# EAGLE design demo_46k22 (EAGLE 9.6.2)
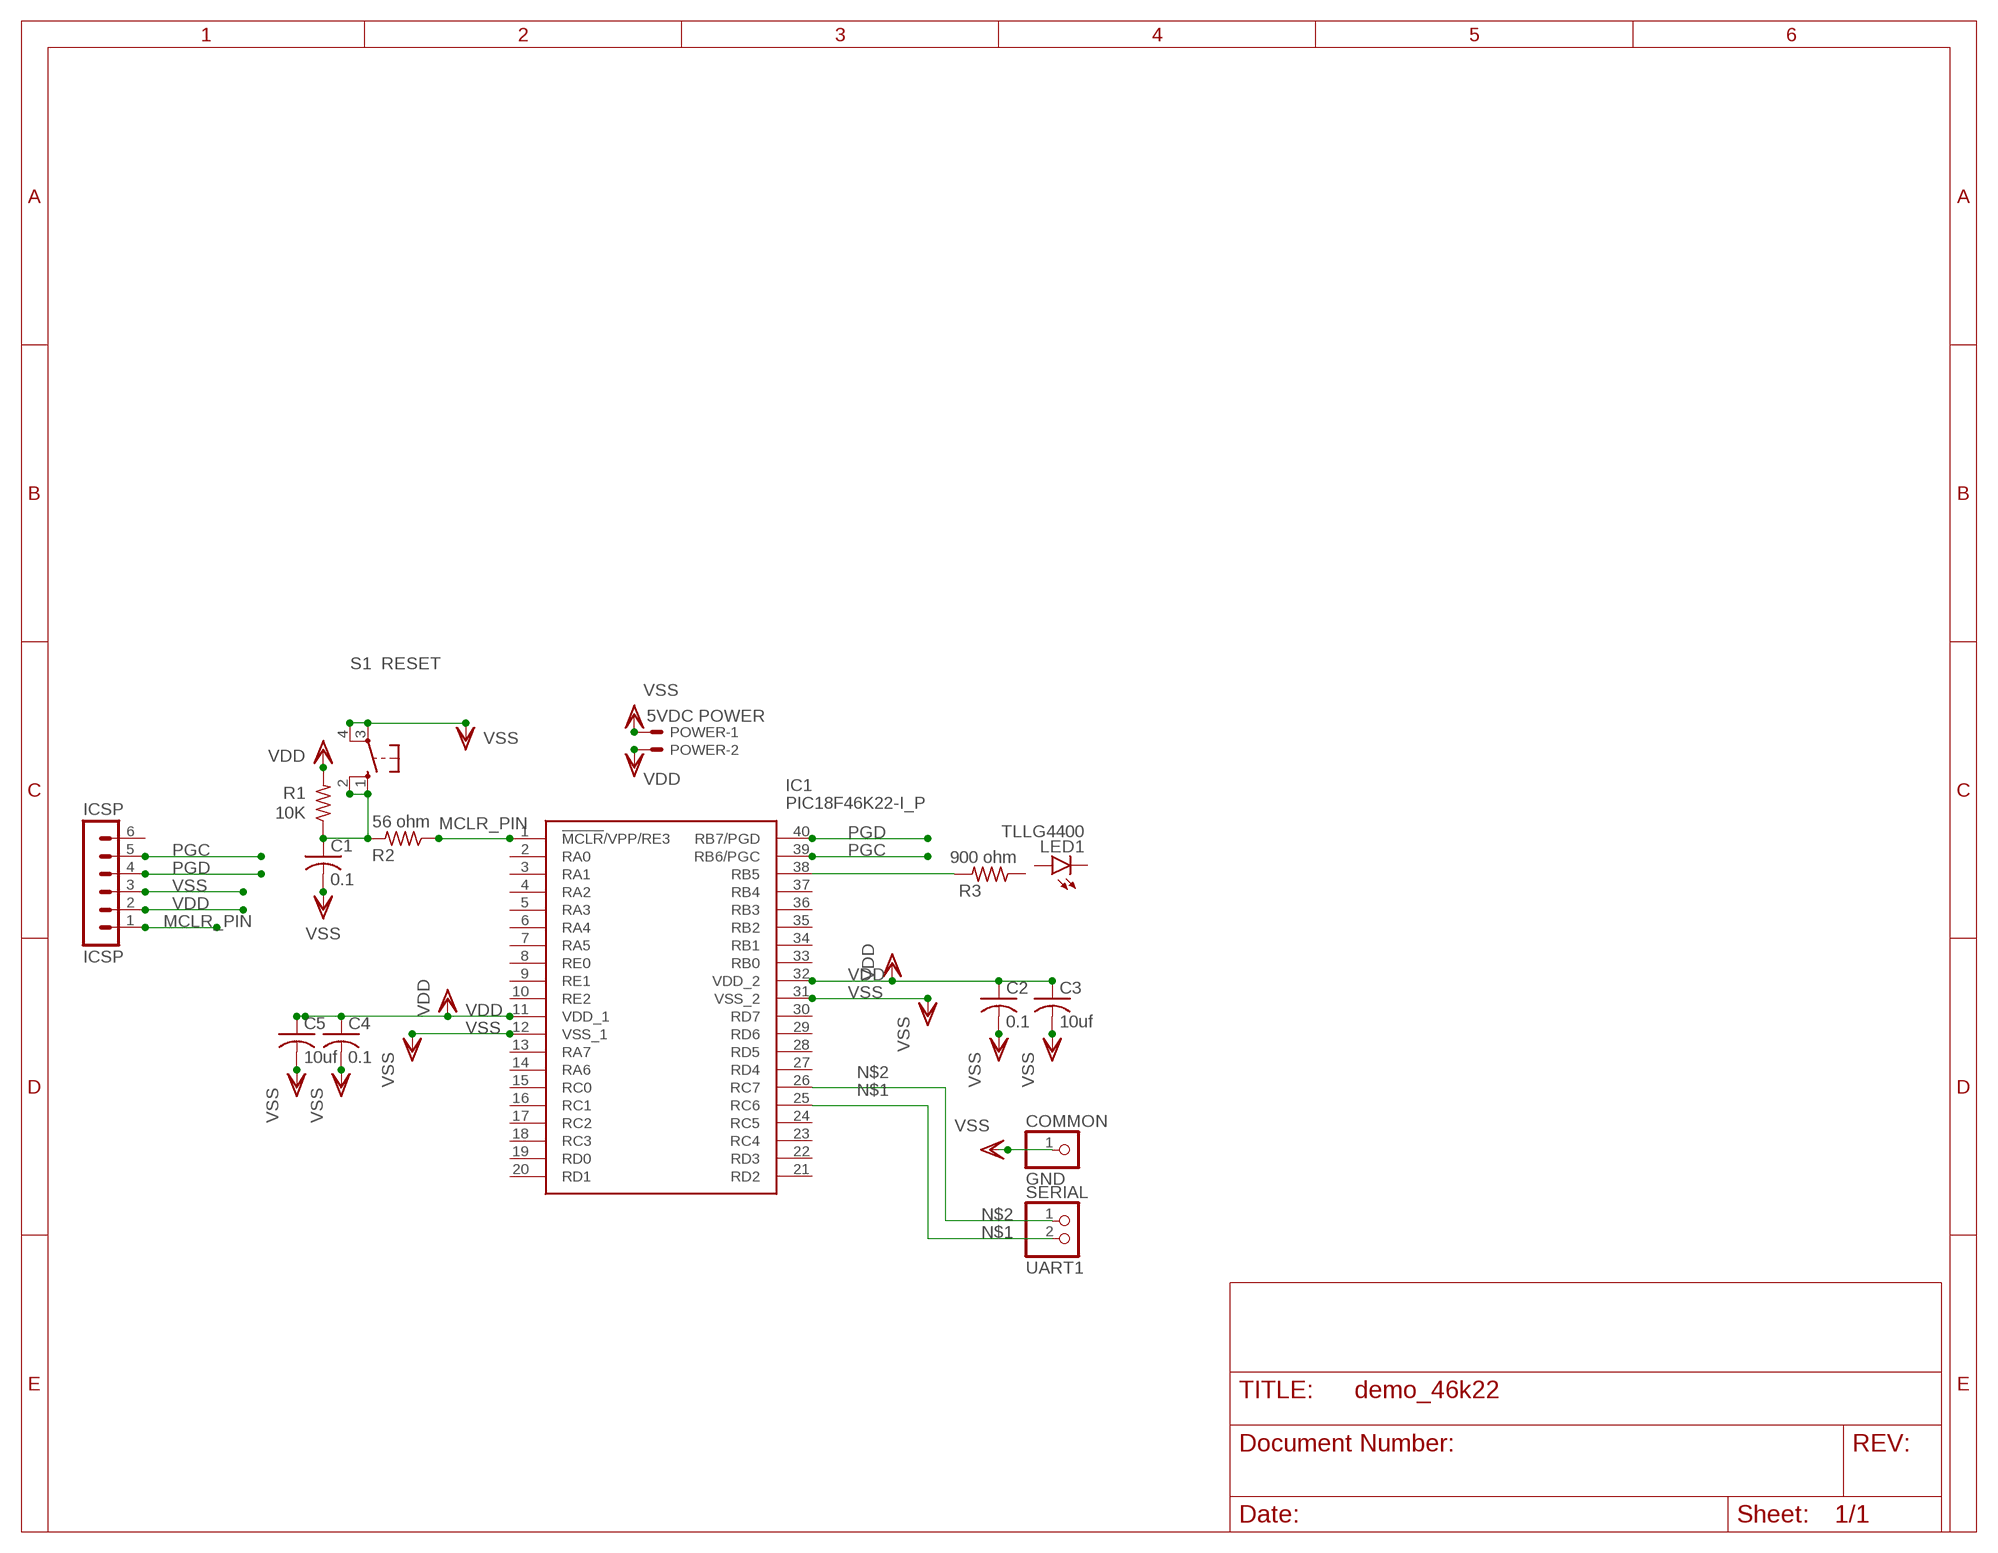
[diagram p0: schematic, sheet 1]

## Parts
C1  0.1  C-US025-030X050  [C025-030X050]
C2  0.1  C-US025-030X050  [C025-030X050]
C3  10uf  C-US025-030X050  [C025-030X050]
C4  0.1  C-US025-030X050  [C025-030X050]
C5  10uf  C-US025-030X050  [C025-030X050]
COMMON  GND  PINHD-1X1  [1X01]
IC1  PIC18F46K22-I_P  [DIP1543W58P254L5175H635Q40N]
ICSP  ICSP  MA06-1  [MA06-1]
LED1  TLLG4400  [LED3MM]
POWER  5VDC POWER  22-23-2021  [22-23-2021]
R1  10K  R-US_0204/7  [0204/7]
R2  56 ohm  R-US_0204/7  [0204/7]
R3  900 ohm  R-US_0204/7  [0204/7]
S1  RESET  10-XX  [B3F-10XX]
SERIAL  UART1  PINHD-1X2  [1X02]

## Nets
MCLR_PIN: IC1.1(!MCLR!/VPP/RE3) ICSP.1 R2.1
MCLR_SW: C1.1 R1.1 R2.2 S1.1(S) S1.2(S1)
N$1: IC1.25(RC6) SERIAL.2
N$2: IC1.26(RC7) SERIAL.1
N$3: IC1.38(RB5) R3.2
PGC: IC1.39(RB6/PGC) ICSP.5
PGD: IC1.40(RB7/PGD) ICSP.4
VDD [icurrent]: C2.1 C3.1 C4.1 C5.1 IC1.11(VDD_1) IC1.32(VDD_2) ICSP.2 POWER.2 R1.2
VSS [icurrent]: C1.2 C2.2 C3.2 C4.2 C5.2 COMMON.1 IC1.12(VSS_1) IC1.31(VSS_2) ICSP.3 POWER.1 S1.3(P) S1.4(P1)
Unconnected: IC1.2(RA0) IC1.3(RA1) IC1.4(RA2) IC1.5(RA3) IC1.6(RA4) IC1.7(RA5) IC1.8(RE0) IC1.9(RE1) IC1.10(RE2) IC1.13(RA7) IC1.14(RA6) IC1.15(RC0) IC1.16(RC1) IC1.17(RC2) IC1.18(RC3) IC1.19(RD0) IC1.20(RD1) IC1.21(RD2) IC1.22(RD3) IC1.23(RC4) IC1.24(RC5) IC1.27(RD4) IC1.28(RD5) IC1.29(RD6) IC1.30(RD7) IC1.33(RB0) IC1.34(RB1) IC1.35(RB2) IC1.36(RB3) IC1.37(RB4) ICSP.6 LED1.A LED1.K(C) R3.1

## Library data of the parts
C1-C5 = rcl:C-US: CAPACITOR, American symbol; SPICEPREFIX: C
COMMON = pinhead:PINHD-1X1: PIN HEADER
IC1 = PIC18F46K22-I_P:PIC18F46K22-I_P: 40-Pin, Low-Power, High-Performance Microcontrollers with XLP Technology Source: Datasheet <https://datasheet.datasheetarchive.com/originals/distributors/Datasheets-DGA18/353826.pdf>; DESCRIPTION: 40-Pin, Low-Power, High-Performance Microcontrollers with XLP Technology; HEIGHT: 6.35mm; MANUFACTURER_NAME: Microchip; MANUFACTURER_PART_NUMBER: PIC18F46K22-I/P; MOUSER_PART_NUMBER: 579-PIC18F46K22IP; MOUSER_PRICE-STOCK: https://www.mouser.co.uk/ProductDetail/Microchip-Technology-Atmel/PIC18F46K22-I-P?qs=RXaOwepKlZ25Gu9j%2FAjmfw%3D%3D
ICSP = con-lstb:MA06-1: PIN HEADER; OC_FARNELL: unknown; OC_NEWARK: unknown
LED1 = led:TLLG4400: Low Current (2mA) LED 3 mm Tinted Diffused Package color GREEN Source: Data sheet <http://www.farnell.com/datasheets/391098.pdf>; MF: VISHAY SEMICONDUCTOR; OC_FARNELL: 1612435
POWER = con-molex:22-23-2021: .100" (2.54mm) Center Header - 2 Pin; MF: MOLEX; MPN: 22-23-2021; OC_FARNELL: 1462926; OC_NEWARK: 25C3832
R1-R3 = rcl:R-US_: RESISTOR, American symbol; SPICEPREFIX: R
S1 = switch-omron:10-XX: OMRON SWITCH; MPN: B3F-1000; OC_FARNELL: 176432; OC_NEWARK: 36M3542
SERIAL = pinhead:PINHD-1X2: PIN HEADER

## Net classes
1 icurrent: width 0.305 mm

## Board
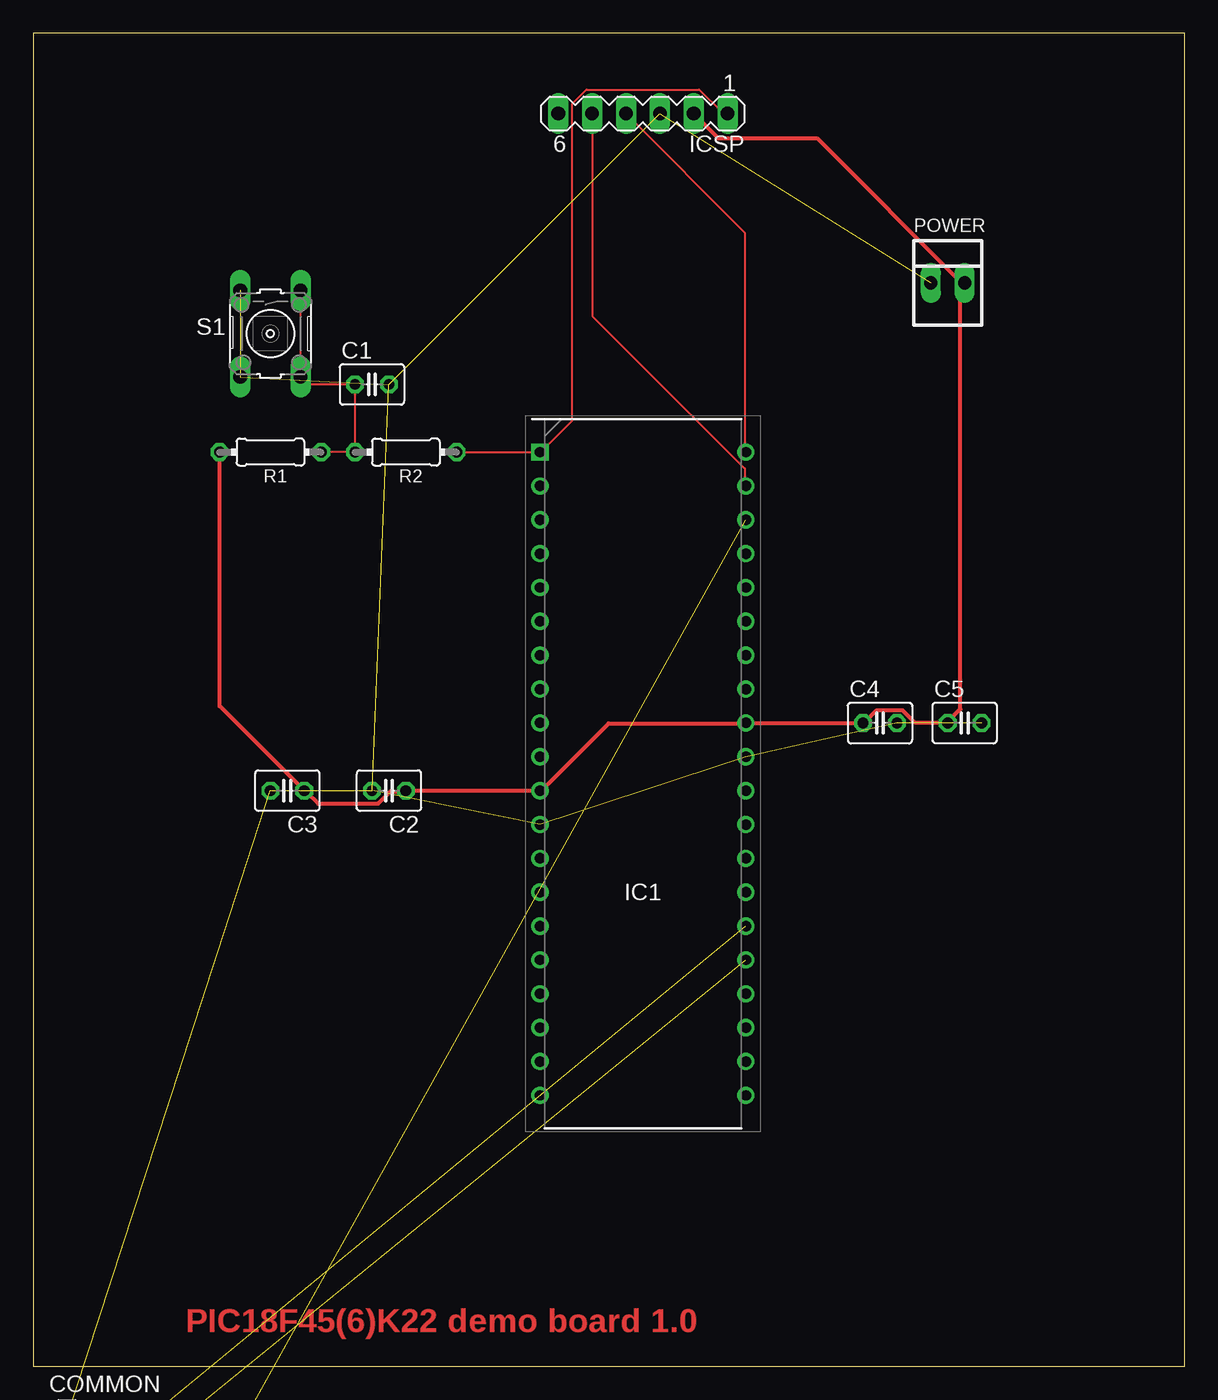
[diagram p1: board, top side]
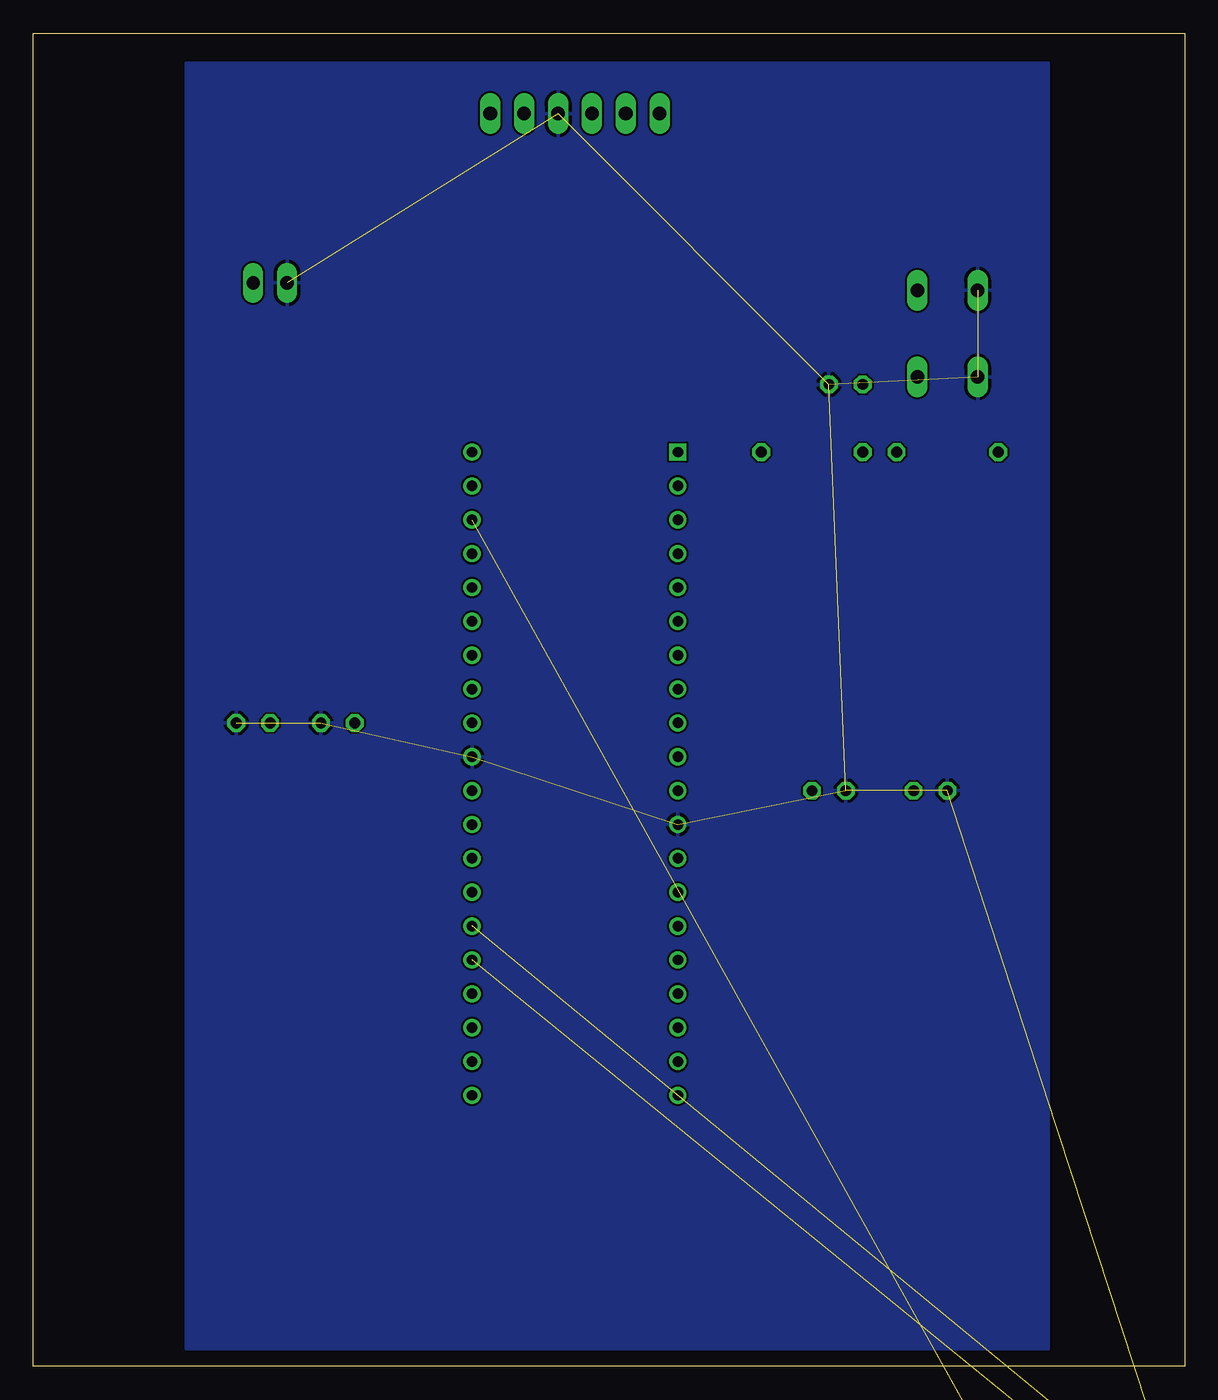
[diagram p2: board, bottom side, seen from below]

Size 86.34 x 100 mm. Coordinates in mm from the lower left corner, seen from the top.
Outline: 0,0 86.34,0 86.34,100 0,100 0,0
Copper layers (1*16): Top 0.035mm / dielectric 1.5mm / Bottom 0.035mm
Design rules "default": minimum track width 6mil, minimum drill 0.35mm, track to track 6mil, track to pad 6mil, pad to pad 6mil, via to via 6mil, smd to smd 6mil, copper to edge 40mil, drill to drill 6mil, minimum pad ring 10mil, minimum via ring 8mil, stop-mask expansion 4mil, vias tented up to drill 0mil, thermal gap 10mil

### Footprints (pad centres in the part's own frame; a part is rotated, then mirrored left to right if it is on the bottom)
C025-030X050 = drill 0.813 octagon: 1 -1.27,0; 2 1.27,0
1X01 = drill 1.016 octagon: 1 0,0
DIP1543W58P254L5175H635Q40N = drill 0.784 pad 1.184 square: 1 -7.715,24.13 | drill 0.784 pad 1.184: 2 -7.715,21.59; 3 -7.715,19.05; 4 -7.715,16.51; 5 -7.715,13.97; 6 -7.715,11.43; 7 -7.715,8.89; 8 -7.715,6.35; 9 -7.715,3.81; 10 -7.715,1.27; 11 -7.715,-1.27; 12 -7.715,-3.81; 13 -7.715,-6.35; 14 -7.715,-8.89; 15 -7.715,-11.43; 16 -7.715,-13.97; 17 -7.715,-16.51; 18 -7.715,-19.05; 19 -7.715,-21.59; 20 -7.715,-24.13; 21 7.715,-24.13; 22 7.715,-21.59; 23 7.715,-19.05; 24 7.715,-16.51; 25 7.715,-13.97; 26 7.715,-11.43; 27 7.715,-8.89; 28 7.715,-6.35; 29 7.715,-3.81; 30 7.715,-1.27; 31 7.715,1.27; 32 7.715,3.81; 33 7.715,6.35; 34 7.715,8.89; 35 7.715,11.43; 36 7.715,13.97; 37 7.715,16.51; 38 7.715,19.05; 39 7.715,21.59; 40 7.715,24.13
MA06-1 = drill 1.016 long: 1 -6.35,0; 2 -3.81,0; 3 -1.27,0; 4 1.27,0; 5 3.81,0; 6 6.35,0
LED3MM = drill 0.813 octagon: A -1.27,0; K 1.27,0
22-23-2021 = drill 1 long: 1 -1.27,0; 2 1.27,0
0204/7 = drill 0.813 octagon: 1 -3.81,0; 2 3.81,0
B3F-10XX = drill 1.016 long: 1 -3.251,2.261; 2 3.251,2.261; 3 -3.251,-2.261; 4 3.251,-2.261
1X02 = drill 1.016 long: 1 -1.27,0; 2 1.27,0

### Placement (x,y rotation side)
C1  25.4,73.66 0 top
C2  26.67,43.18 180 top
C3  19.05,43.18 180 top
C4  63.5,48.26 0 top
C5  69.85,48.26 0 top
COMMON  2.54,-3.81 0 top  (outside the outline)
IC1  45.72,44.45 0 top
ICSP  45.72,93.98 180 top
LED1  2.54,-20.32 0 top  (outside the outline)
POWER  68.58,81.28 0 top
R1  17.78,68.58 180 top
R2  27.94,68.58 180 top
R3  5.08,-16.51 0 top  (outside the outline)
S1  17.78,77.47 270 top
SERIAL  3.81,-8.89 0 top  (outside the outline)

### Tracks (layer width: path | path; a pad name or v marks a point on that pad's centre or on a via)
MCLR_PIN
  Top 0.152: R2.1 IC1.1 38.05,68.58 40.41,70.94 40.41,94.72 41.48,95.78 49.94,95.78 51.69,94.03 52.07,94.03 ICSP.1
MCLR_SW
  Top 0.152: 24.1,68.58 R1.1 | 20.07,74.22 20.6,73.69 24.1,73.69 C1.1 24.1,73.61 24.1,68.58 | 20.07,74.22 20.07,80.7 S1.1 | 20.07,74.22 S1.2 | 24.1,68.58 R2.2
N$1  (1 unrouted)
N$2  (1 unrouted)
N$3  (1 unrouted)
PGC
  Top 0.152: IC1.39 53.37,66.06 53.37,67.36 41.94,78.79 41.94,93.95 ICSP.5
PGD
  Top 0.152: IC1.40 53.37,68.58 53.37,85.04 44.45,93.95 ICSP.4
VDD
  Top 0.305: ICSP.2 51.38,92.13 58.78,92.13 69.6,81.31 69.82,81.31 POWER.2 69.52,81.23 69.52,49.3 68.6,48.39 C5.1 68.53,48.31 66.09,48.31 65.18,49.23 63.27,49.23 62.36,48.31 C4.1 62.21,48.23 53.44,48.23 IC1.32 53.29,48.23 43.16,48.23 38.12,43.2 IC1.11 37.97,43.2 27.99,43.2 C2.1 27.84,43.13 26.77,43.13 25.86,42.22 21.36,42.22 20.45,43.13 C3.1 13.97,49.53 R1.2
VSS  (11 unrouted)
  pour Bottom: 10.16,97.79 74.93,97.79 74.93,1.27 12.7,1.27 10.16,1.27

### Text on the board
Top: PIC18F45(6)K22 demo board 1.0